# EAGLE design SipPuffOneOuputATtiny85MOSFET (EAGLE 9.1.3)
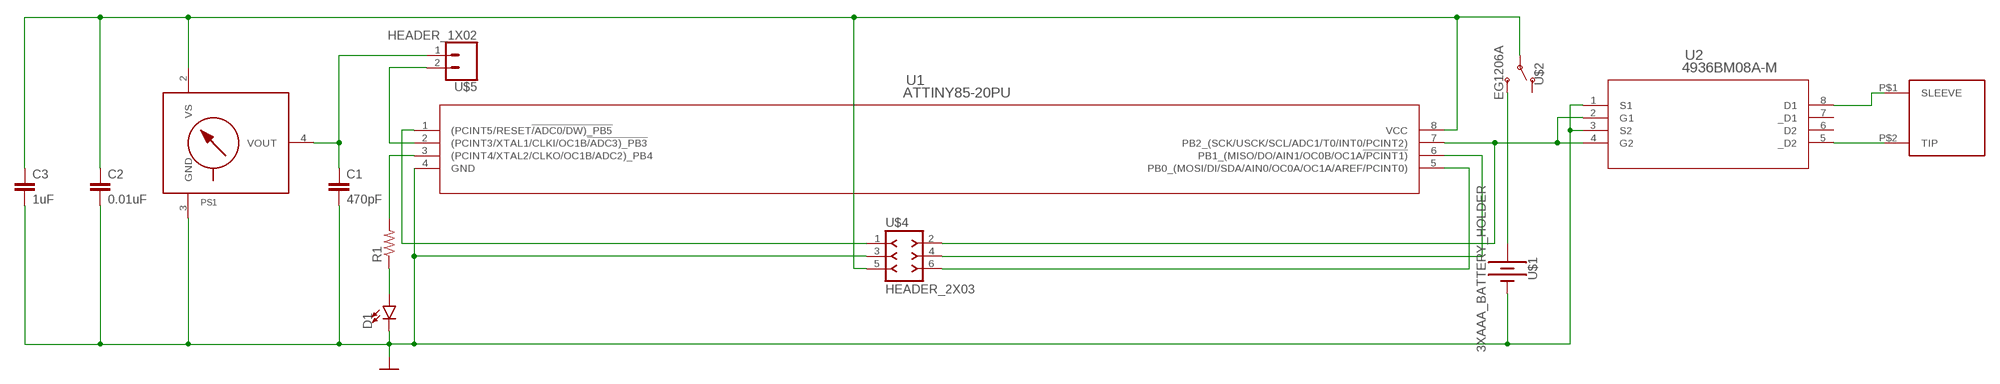
[diagram p0: schematic, sheet 1]

## Parts
C1  470pF  0.1UF-KIT-EZ-50V-20%  [CAP-PTH-SMALL-KIT]
C2  0.01uF  0.1UF-KIT-EZ-50V-20%  [CAP-PTH-SMALL-KIT]
C3  1uF  0.1UF-KIT-EZ-50V-20%  [CAP-PTH-SMALL-KIT]
D1  LED5MM  [LED_5MM]
PS1  MPX-1351  [1351]
R1  RESISTOR_R-US_  [RESISTOR_0207/10]
U1  ATTINY85-20PU  [8P3]
U2  4936BM08A-M  [M08A-M]
U$1  3XAAA_BATTERY_HOLDER  [3XAAA_BATTERY_HOLDER]
U$2  EG1206A  [EG1206A]
U$3  MONO_WIRE  [MONO_WIRE]
U$4  HEADER_2X03  [2X3]
U$5  HEADER_1X02  [1X02]

## Nets
GND: C1.2 C2.2 C3.2 D1.K(C) PS1.3(GND) U1.4(GND) U2.1(S1) U2.3(S2) U$1.P$2(-) U$4.3
N$1: C1.1 PS1.4(VOUT) U$5.1
N$2: C2.1 C3.1 PS1.2(VS) U1.8(VCC) U$2.2(P) U$4.5
N$3: U$1.P$1(+) U$2.3(S)
N$4: R1.2 U1.3((PCINT4/XTAL2/CLKO/OC1B/ADC2)_PB4)
N$5: D1.A R1.1
N$6: U2.5(_D2) U$3.P$2(TIP)
N$7: U1.7(PB2_(SCK/USCK/SCL/ADC1/T0/INT0/PCINT2)) U2.2(G1) U2.4(G2) U$4.2
N$8: U2.8(D1) U$3.P$1(SLEEVE)
N$9: U1.1((PCINT5/RESET!/ADC0/DW)_PB5) U$4.1
N$10: U1.2((PCINT3/XTAL1/CLKI/OC1B!/ADC3)_PB3) U$5.2
N$12: U1.6(PB1_(MISO/DO/AIN1/OC0B/OC1A!/PCINT1)) U$4.4
N$13: U1.5(PB0_(MOSI/DI/SDA/AIN0/OC0A/OC1A/AREF/PCINT0)) U$4.6
Unconnected: PS1.1(NC) PS1.5(NC) PS1.6(NC) U2.6(D2) U2.7(_D1) U$2.1(O)

## Library data of the parts
C1-C3 = MMC Eagle:0.1UF: 0.1µF ceramic capacitors A capacitor is a passive two-terminal electrical component used to store electrical energy temporarily in an electric field.; PROD_ID: CAP-08370; VALUE: 0.1uF
D1 = MMC Eagle:LED: LED (Generic) Standard schematic elements and footprints for 5mm, 3mm, 1206, and 0603 sized LEDs. Generic LEDs with no color specified.
PS1 = MMC Eagle:MPX*****: Generic MPX pressure sensor
R1 = MMC Eagle:RESISTOR_R-US_: RESISTOR, American symbol
U1 = MMC Eagle:ATTINY85-20PU; MANUFACTURER_PART_NUMBER: ATTINY8520PU; VENDOR: Atmel
U2 = MMC Eagle:4936B; MANUFACTURER_PART_NUMBER: LM34DM; VENDOR: Texas Instruments
U$1 = MMC Eagle:3XAAA_BATTERY_HOLDER
U$2 = MMC Eagle:EG1206A
U$3 = MMC Eagle:MONO_WIRE
U$4 = MMC Eagle:HEADER_2X03
U$5 = MMC Eagle:HEADER_1X02

## Board
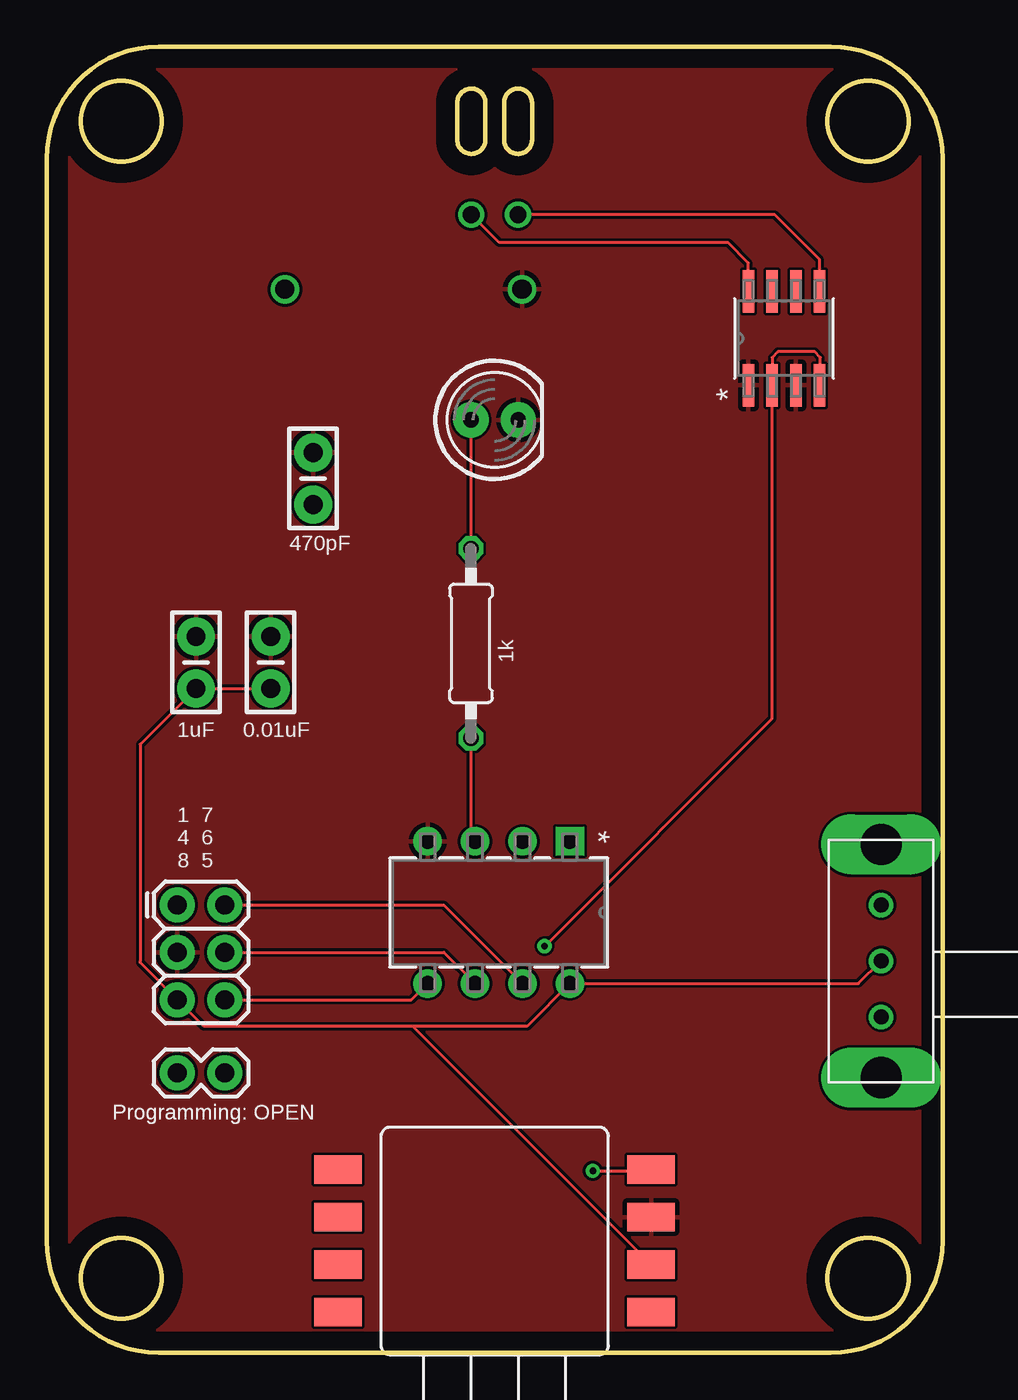
[diagram p1: board, top side]
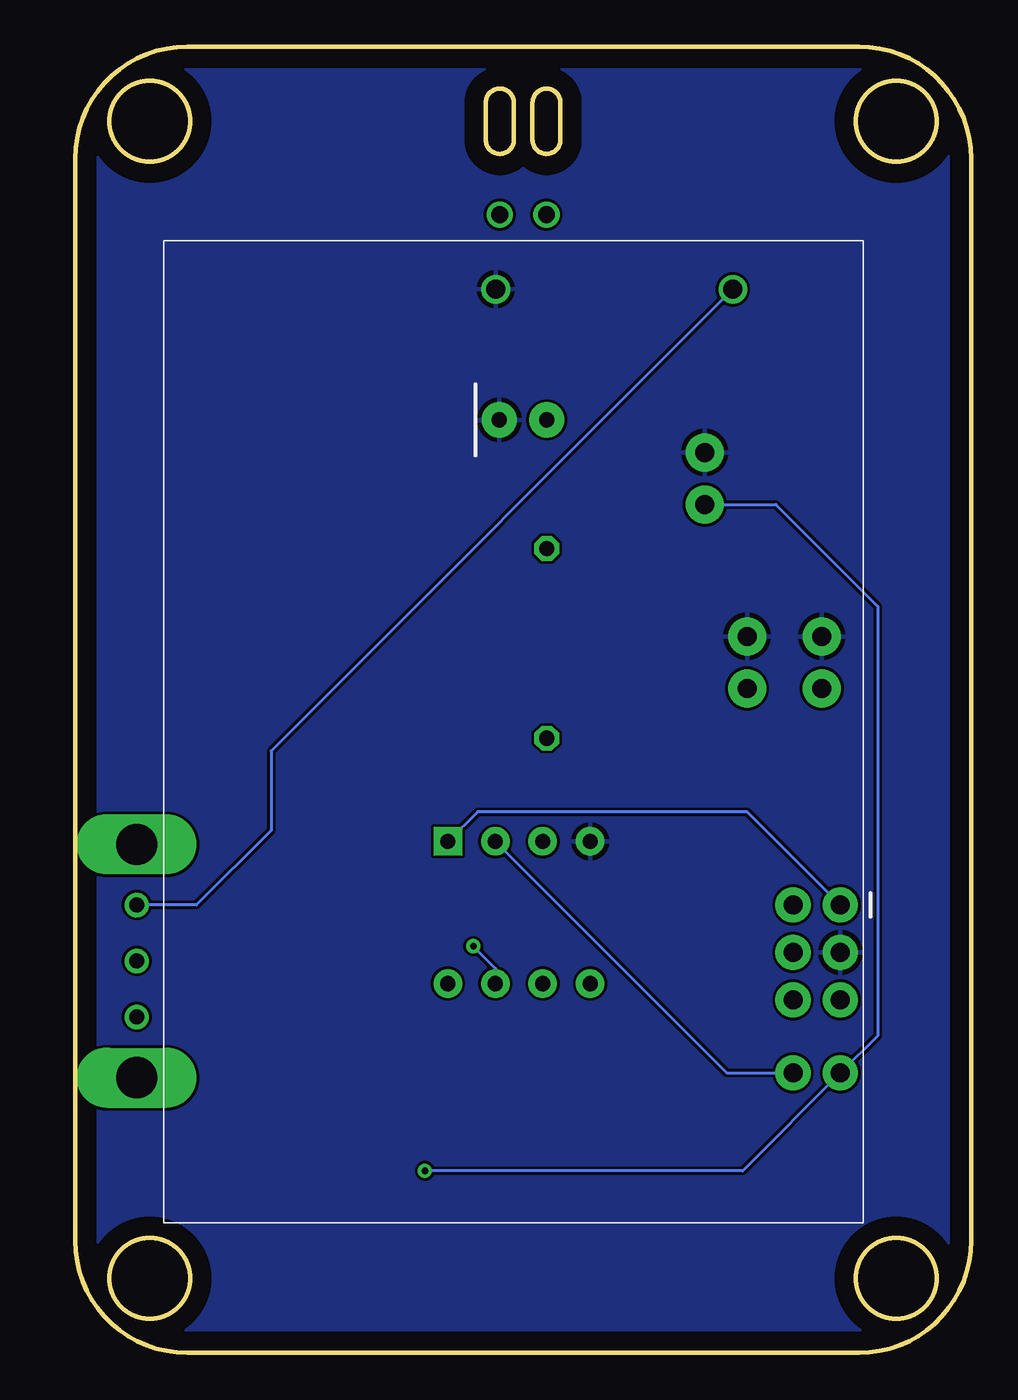
[diagram p2: board, bottom side, seen from below]

Size 48 x 70 mm. Coordinates in mm from the lower left corner, seen from the top.
Outline: 26,67 arc180 24.5,67
Outline: 24.5,67 arc-180 26,67
Outline: 26,67 26,65
Outline: 26,65 arc-180 24.5,65
Outline: 24.5,65 24.5,67
Outline: 26,65 26,67
Outline: 24.5,65 arc180 26,65
Outline: 22,65 arc180 23.5,65
Outline: 23.5,65 arc-180 22,65
Outline: 22,65 22,67
Outline: 22,67 arc-180 23.5,67
Outline: 23.5,67 23.5,65
Outline: 23.5,65 23.5,67
Outline: 23.5,67 arc180 22,67
Outline: 22,65 22,67
Outline: 22,67 arc-180 23.5,67
Outline: 23.5,67 23.5,65
Outline: 23.5,65 arc-180 22,65
Outline: 24.5,67 24.5,65
Outline: 24.5,65 arc180 26,65
Outline: 26,65 26,67
Outline: 26,67 arc180 24.5,67
Outline: 42,0 6,0 arc-90 0,6 0,64 arc-90 6,70 42,70 arc-90 48,64 48,6 arc-90 42,0
Outline: circle at 4,66 radius 2.15
Outline: circle at 44,66 radius 2.15
Outline: circle at 4,4 radius 2.15
Outline: circle at 44,4 radius 2.15
Copper layers (1*16): Top 0.035mm / dielectric 1.5mm / Bottom 0.035mm
Design rules "default": minimum track width 6mil, minimum drill 0.35mm, track to track 6mil, track to pad 6mil, pad to pad 6mil, via to via 6mil, smd to smd 6mil, copper to edge 40mil, drill to drill 6mil, minimum pad ring 10mil, minimum via ring 8mil, stop-mask expansion 4mil, vias tented up to drill 0mil, thermal gap 10mil

### Footprints (pad centres in the part's own frame; a part is rotated, then mirrored left to right if it is on the bottom)
CAP-PTH-SMALL-KIT = drill 1.016 pad 2.032: 1 -1.397,0; 2 1.397,0
LED_5MM = drill 0.813 pad 1.88: A -1.27,0; K 1.27,0
1351 = smd 2.54 x 1.524: 1 8.382,-3.81; 2 8.382,-1.27; 3 8.382,1.27; 4 8.382,3.81; 5 -8.382,3.81; 6 -8.382,1.27; 7 -8.382,-1.27; 8 -8.382,-3.81
RESISTOR_0207/10 = drill 0.813 octagon: 1 -5.08,0; 2 5.08,0
8P3 = drill 0.813 pad 1.524 square: 1 -7.62,7.62 | drill 0.813 pad 1.524: 2 -7.62,5.08; 3 -7.62,2.54; 4 -7.62,0; 5 0,0; 6 0,2.54; 7 0,5.08; 8 0,7.62
M08A-M = smd 2.286 x 0.61: 1 -2.515,1.905; 2 -2.515,0.635; 3 -2.515,-0.635; 4 -2.515,-1.905; 5 2.515,-1.905; 6 2.515,-0.635; 7 2.515,0.635; 8 2.515,1.905
3XAAA_BATTERY_HOLDER = drill 1.02: P$1 50.035,6.995; P$2 50.035,19.695
EG1206A = drill 0.8: 1 3.5,2.8; 2 6.5,2.8; 3 9.5,2.8 | drill 2.2 pad 2.54 long: MT1 0.25,2.8; MT2 12.75,2.8
MONO_WIRE = drill 0.9: P$1 -1.25,0; P$2 1.25,0
2X3 = drill 1.016 pad 1.88: 1 0,0; 2 0,2.54; 3 2.54,0; 4 2.54,2.54; 5 5.08,0; 6 5.08,2.54
1X02 = drill 1.016 pad 1.88: 1 0,0; 2 2.54,0

### Placement (x,y rotation side)
C1  14.27,46.86 90 top
C2  12,37 90 top
C3  8,37 90 top
D1  24,50 0 top
PS1  24,6 0 top
R1  22.73,38.02 270 top
U1  20.41,19.79 270 top
U2  39.5,54.37 90 top
U$1  5.77,6.96 90 bottom
U$2  47.5,14.5 90 top
U$3  24,61 0 top
U$4  7,24 270 top
U$5  7,15 0 top

### Tracks (layer width: path | path; a pad name or v marks a point on that pad's centre or on a via)
GND
  pour Top: -2.5,72 50,72 50,-1 50,-2 -2.5,-2
  pour Bottom: -2.5,72 51.5,72 52.5,72 52.5,-2 -2.5,-2
N$1  (via drill 0.35)
  Top 0.152: v29.26,9.75 32.31,9.75 PS1.4
  Bottom 0.152: C1.1 10.46,45.46 5,40 5,17 U$5.1 12.25,9.75 v29.26,9.75
N$2
  Top 0.152: C2.1 C3.1 5,32.6 5,21 5,20.92 U$4.5 8.42,17.5 19.5,17.5 | 19.5,17.5 25.74,17.5 U1.8 43.49,19.79 U$2.2 | PS1.2 19.61,17.5 19.5,17.5
N$3
  Bottom 0.152: U$1.P$1 37.5,32.26 37.5,28 41.5,24 U$2.3
N$4
  Top 0.152: R1.2 22.73,27.63 U1.3
N$5
  Top 0.152: D1.A R1.1
N$6
  Top 0.152: 41.45,57 U2.5 41.41,58.59 39,61 U$3.P$2
N$7  (via drill 0.35)
  Top 0.152: U2.4 41.45,51.97 41.45,53.34 41.15,53.65 39.17,53.65 38.86,53.34 38.86,51.97 U2.2 38.86,51.82 38.86,33.98 v26.67,21.79 | U$4.2 21.28,24 U1.7
  Bottom 0.152: v26.67,21.79 25.49,20.61 U1.7
N$8
  Top 0.152: 37.49,57 U2.8 37.59,58.41 36.5,59.5 24.25,59.5 U$3.P$1
N$9
  Bottom 0.152: U$4.1 12,29 26.44,29 U1.1
N$10
  Bottom 0.152: U1.2 13.08,15 U$5.2
N$12
  Top 0.152: U$4.4 21.28,21.46 U1.6
N$13
  Top 0.152: U$4.6 19.54,18.92 U1.5

### Text on the board
tPlace: 470pF | 1k | 1uF | 0.01uF | 1 7 / 4 6 / 8 5 | Programming: OPEN | Programming: OPEN